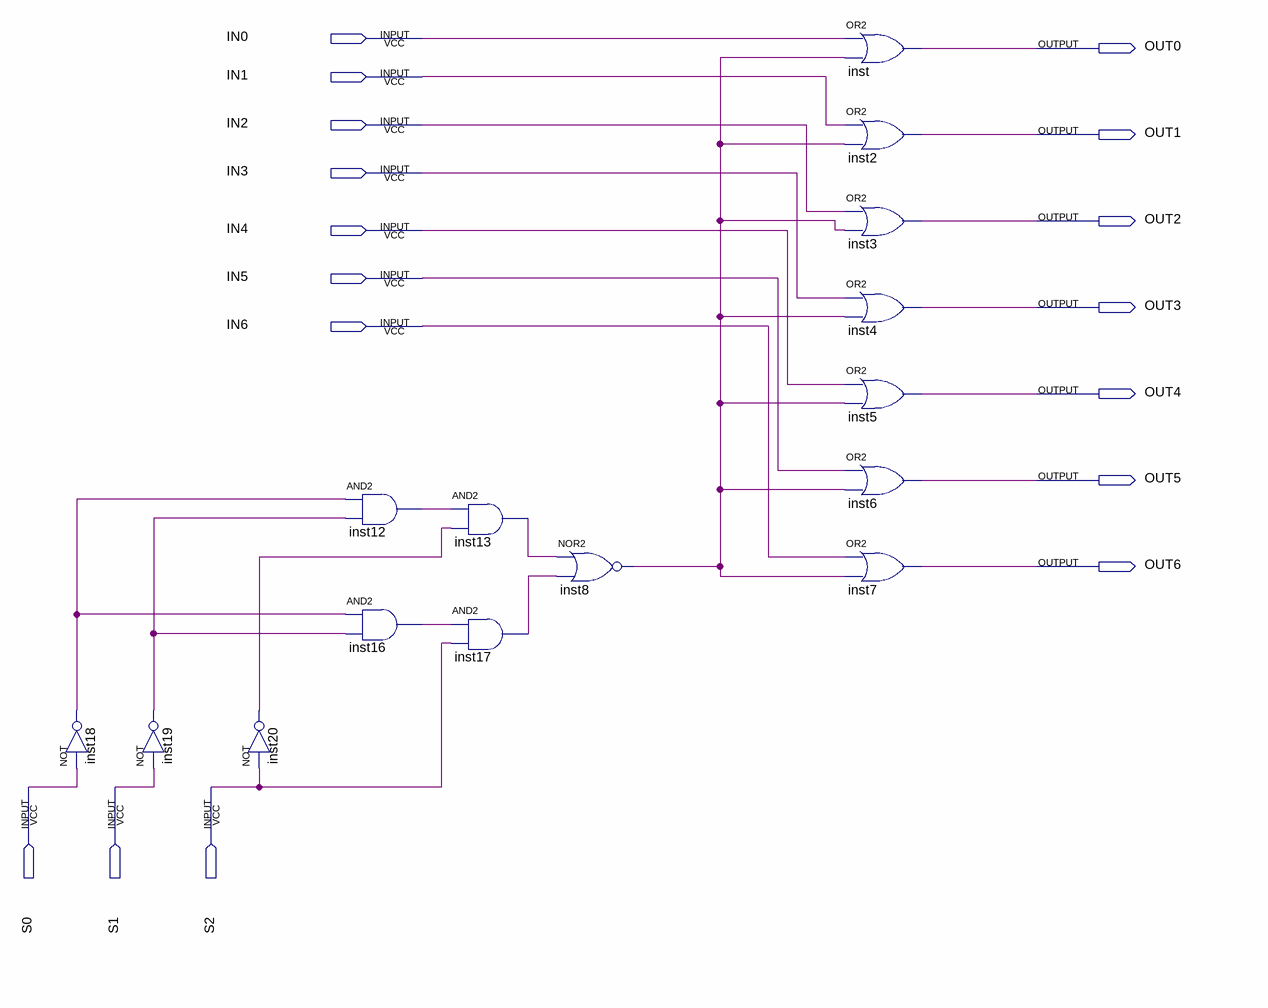
[diagram p0: schematic sheet]
// Quartus schematic sdProjectMuxDec.bdf as structural Verilog: 15 symbols, 17 pins
module sdProjectMuxDec (
  input  IN0,
  input  IN1,
  input  IN2,
  input  IN3,
  input  IN4,
  input  IN5,
  input  IN6,
  input  S0,
  input  S1,
  input  S2,
  output OUT0,
  output OUT1,
  output OUT2,
  output OUT3,
  output OUT4,
  output OUT5,
  output OUT6
);

  wire inst8_out, inst12_out, inst13_out, inst16_out, inst17_out, inst18_out, inst19_out, inst20_out;

  not inst18 (inst18_out, S0);
  not inst19 (inst19_out, S1);
  not inst20 (inst20_out, S2);
  and inst12 (inst12_out, inst18_out, inst19_out);
  and inst16 (inst16_out, inst18_out, inst19_out);
  and inst13 (inst13_out, inst12_out, inst20_out);
  and inst17 (inst17_out, inst16_out, S2);
  nor inst8 (inst8_out, inst13_out, inst17_out);
  or inst (OUT0, IN0, inst8_out);
  or inst2 (OUT1, IN1, inst8_out);
  or inst3 (OUT2, IN2, inst8_out);
  or inst4 (OUT3, IN3, inst8_out);
  or inst5 (OUT4, IN4, inst8_out);
  or inst6 (OUT5, IN5, inst8_out);
  or inst7 (OUT6, IN6, inst8_out);
endmodule
